# EAGLE design Hb_Wireless_TWELITE_2main (EAGLE 8.4.3)
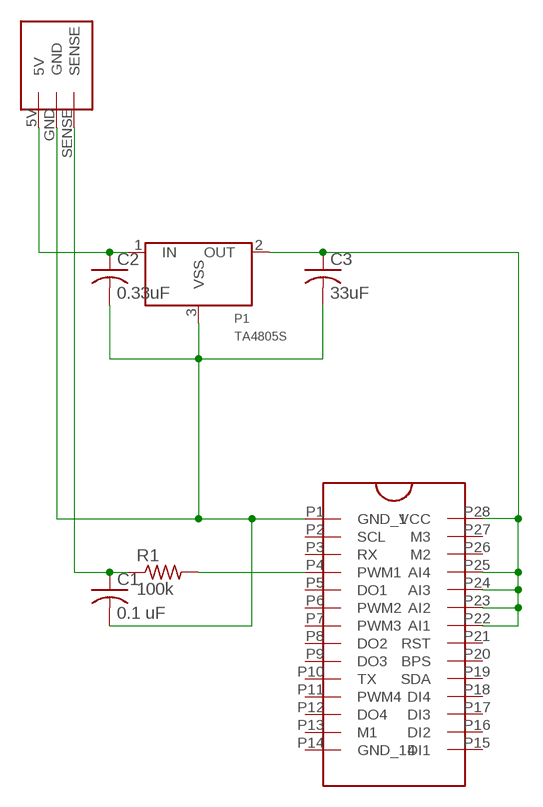
[diagram p0: schematic, sheet 1]

## Parts
C1  0.1 uF  C-US050-024X044  [C050-024X044]
C2  0.33uF  C-US050-024X044  [C050-024X044]
C3  33uF  C-US050-024X044  [C050-024X044]
P1  TA4805S  [TA48**S]
R1  100k  R-US_0207/7  [0207/7]
U$1  TWE-LITE-DIP  [TWE-LITE-DIP]
U$2  CON2MAIN  [CON2MAIN]

## Nets
N$1: C1.2 C2.2 C3.2 P1.3(VSS) U$1.P1(GND_1) U$2.GND
N$2: C3.1 P1.2(OUT) U$1.P22(AI1) U$1.P23(AI2) U$1.P24(AI3) U$1.P25(AI4) U$1.P28(VCC)
N$3: C2.1 P1.1(IN) U$2.5V
N$4: C1.1 R1.1 U$2.SENSE
N$5: R1.2 U$1.P4(PWM1)
Unconnected: U$1.P2(SCL) U$1.P3(RX) U$1.P5(DO1) U$1.P6(PWM2) U$1.P7(PWM3) U$1.P8(DO2) U$1.P9(DO3) U$1.P10(TX) U$1.P11(PWM4) U$1.P12(DO4) U$1.P13(M1) U$1.P14(GND_14) U$1.P15(DI1) U$1.P16(DI2) U$1.P17(DI3) U$1.P18(DI4) U$1.P19(SDA) U$1.P20(BPS) U$1.P21(RST) U$1.P26(M2) U$1.P27(M3)

## Library data of the parts
C1-C3 = resistor:C-US: CAPACITOR, American symbol
P1 = Voltage Regulator:TA48*
R1 = resistor:R-US_: RESISTOR, American symbol
U$1 = HbWireless:TWE-LITE-DIP
U$2 = HbWireless:CON2MAIN

## Board
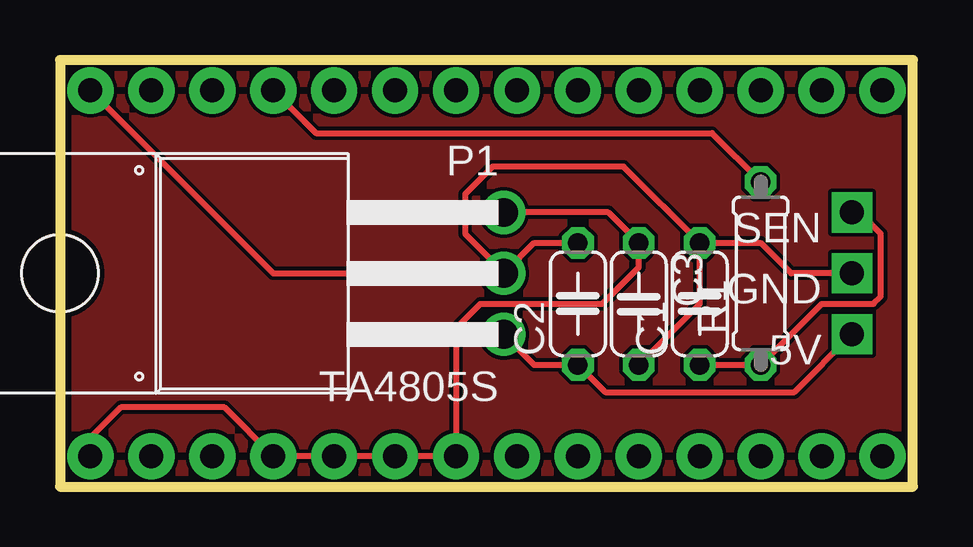
[diagram p1: board, top side]
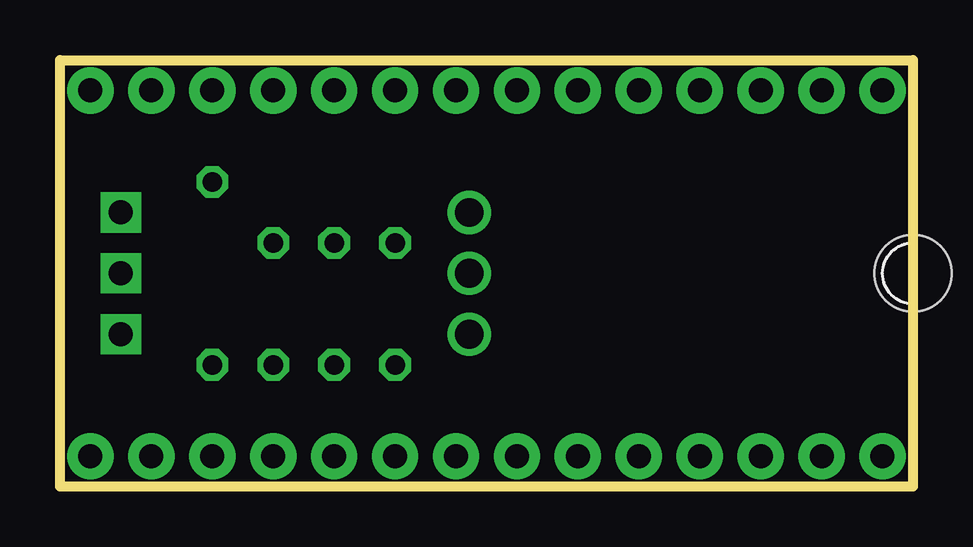
[diagram p2: board, bottom side, seen from below]

Size 35.56 x 17.78 mm. Coordinates in mm from the lower left corner, seen from the top.
Outline: 0,17.78 0,0 35.56,0 35.56,17.78 0,17.78
Copper layers (1*16): Top 0.035mm / dielectric 1.5mm / Bottom 0.035mm
Design rules "default *": minimum track width 6mil, minimum drill 0.35mm, track to track 6mil, track to pad 6mil, pad to pad 6mil, via to via 6mil, smd to smd 6mil, copper to edge 10mil, drill to drill 10mil, minimum pad ring 10mil, minimum via ring 8mil, stop-mask expansion 4mil, vias tented up to drill 0mil, thermal gap 10mil

### Footprints (pad centres in the part's own frame; a part is rotated, then mirrored left to right if it is on the bottom)
C050-024X044 = drill 0.813 octagon: 1 -2.54,0; 2 2.54,0
TA48**S = drill 1.2: 1 -2.54,-18.5; 2 2.54,-18.5; 3 0,-18.5 | hole 3.2: 0,0
0207/7 = drill 0.813 octagon: 1 -3.81,0; 2 3.81,0
TWE-LITE-DIP = drill 1 pad 1.93: P1 0,-7.62; P2 2.54,-7.62; P3 5.08,-7.62; P4 7.62,-7.62; P5 10.16,-7.62; P6 12.7,-7.62; P7 15.24,-7.62; P8 17.78,-7.62; P9 20.32,-7.62; P10 22.86,-7.62; P11 25.4,-7.62; P12 27.94,-7.62; P13 30.48,-7.62; P14 33.02,-7.62; P15 33.02,7.62; P16 30.48,7.62; P17 27.94,7.62; P18 25.4,7.62; P19 22.86,7.62; P20 20.32,7.62; P21 17.78,7.62; P22 15.24,7.62; P23 12.7,7.62; P24 10.16,7.62; P25 7.62,7.62; P26 5.08,7.62; P27 2.54,7.62; P28 0,7.62
CON2MAIN = drill 1 pad 1.676 square: 5V 0,0; GND 0,-2.54; SENSE 0,-5.08

### Placement (x,y rotation side)
C1  26.67,7.62 90 top
C2  21.59,7.62 90 top
C3  24.13,7.62 270 top
P1  0,8.89 90 top
R1  29.21,8.89 90 top
U$1  1.27,8.89 180 bottom
U$2  33.02,6.35 180 top

### Tracks (layer width: path | path; a pad name or v marks a point on that pad's centre or on a via)
N$1
  Top 0.254: U$2.GND 30.48,8.89 29.21,10.16 C1.2 | 18.58,8.98 P1.3 8.89,8.89 U$1.P1 | 18.58,8.98 19.77,10.16 C2.2 | C1.2 23.5,13.34 18.03,13.34 16.89,12.19 16.89,10.54 18.46,8.98 18.58,8.98 | C3.2 26.67,7.62 C1.2
N$2
  Top 0.254: P1.2 22.86,11.43 C3.1 24.13,9.14 22.61,7.62 17.53,7.62 16.51,6.6 U$1.P22 U$1.P23 U$1.P24 U$1.P25 6.86,3.3 2.54,3.3 1.27,2.03 U$1.P28
N$3
  Top 0.254: P1.1 19.77,5.08 C2.1 22.73,3.94 30.61,3.94 U$2.5V
N$4
  Top 0.254: C1.1 R1.1 31.75,7.62 33.91,7.62 34.21,7.93 34.21,10.54 33.33,11.43 U$2.SENSE
N$5
  Top 0.254: U$1.P4 10.67,14.73 27.18,14.73 R1.2
N$6
  pour Top: 0,17.78 0,0 35.56,0 35.56,17.78